# EAGLE design ESP32-ADC (EAGLE 9.6.2)
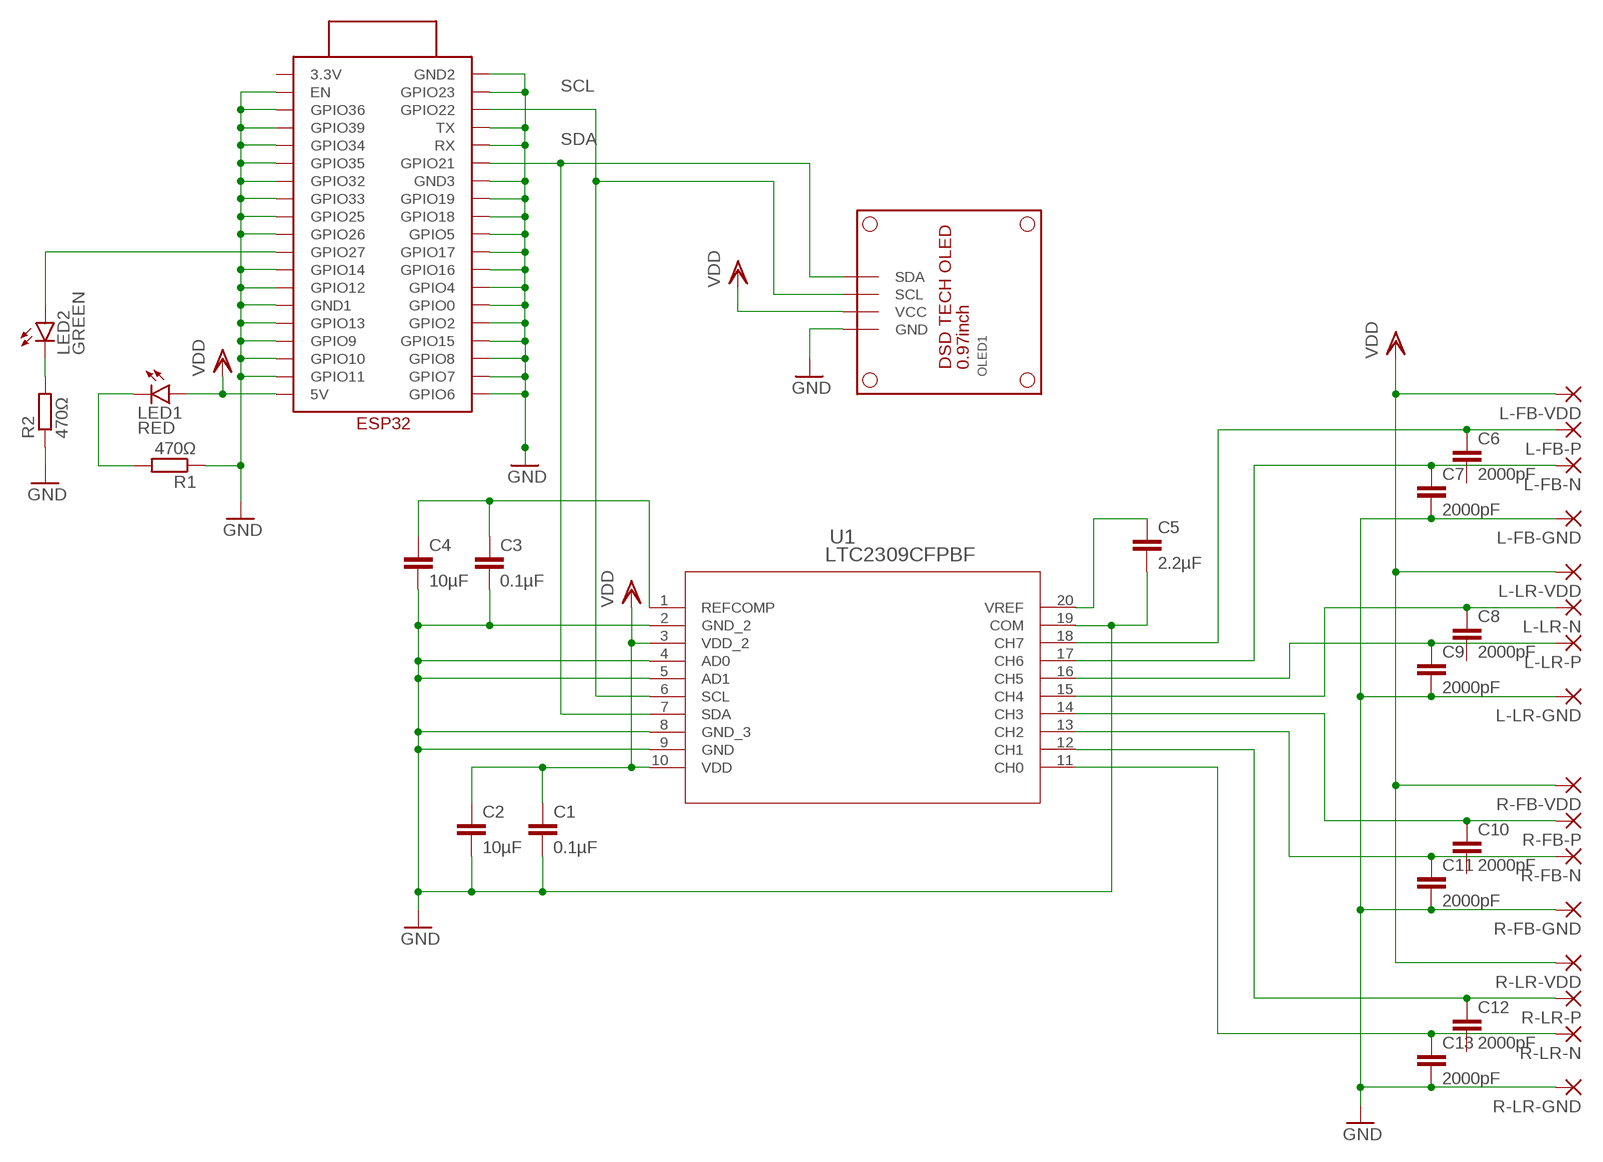
[diagram p0: schematic, sheet 1]

## Parts
C1  0.1µF  C-EUC3216  [C3216]
C2  10µF  C-EUC3216  [C3216]
C3  0.1µF  C-EUC3216  [C3216]
C4  10µF  C-EUC3216  [C3216]
C5  2.2µF  C-EUC3216  [C3216]
C6  2000pF  C-EUC3216  [C3216]
C7  2000pF  C-EUC3216  [C3216]
C8  2000pF  C-EUC3216  [C3216]
C9  2000pF  C-EUC3216  [C3216]
C10  2000pF  C-EUC3216  [C3216]
C11  2000pF  C-EUC3216  [C3216]
C12  2000pF  C-EUC3216  [C3216]
C13  2000pF  C-EUC3216  [C3216]
L-FB-GND  SMD2  [SMD1,27-2,54]
L-FB-N  SMD2  [SMD1,27-2,54]
L-FB-P  SMD2  [SMD1,27-2,54]
L-FB-VDD  SMD2  [SMD1,27-2,54]
L-LR-GND  SMD2  [SMD1,27-2,54]
L-LR-N  SMD2  [SMD1,27-2,54]
L-LR-P  SMD2  [SMD1,27-2,54]
L-LR-VDD  SMD2  [SMD1,27-2,54]
LED1  RED  LED3MM  [LED3MM]
LED2  GREEN  LED3MM  [LED3MM]
OLED1  DSDTECH_ARDUINO_AVRCOMPATIBLE_IIC_OLED  [DSDTECH0.96"ARDUINOAVRCOMPATIBLEIICOLEDLCDSCREENSUPPORTU8GLIB]
R1  470Ω  R-EU_R3216W  [R3216W]
R2  470Ω  R-EU_R3216W  [R3216W]
R-FB-GND  SMD2  [SMD1,27-2,54]
R-FB-N  SMD2  [SMD1,27-2,54]
R-FB-P  SMD2  [SMD1,27-2,54]
R-FB-VDD  SMD2  [SMD1,27-2,54]
R-LR-GND  SMD2  [SMD1,27-2,54]
R-LR-N  SMD2  [SMD1,27-2,54]
R-LR-P  SMD2  [SMD1,27-2,54]
R-LR-VDD  SMD2  [SMD1,27-2,54]
U1  LTC2309CFPBF  [TSSOP-20_F_LIT]
U$2  ESP32ESP32_WIFI  [ESP32_WIFI]

## Nets
GND: C1.2 C2.2 C3.2 C4.2 C5.2 C7.2 C9.2 C11.2 C13.2 L-FB-GND.1(P) L-LR-GND.1(P) OLED1.GND R1.1 R2.1 R-FB-GND.1(P) R-LR-GND.1(P) U1.2(GND_2) U1.4(AD0) U1.5(AD1) U1.8(GND_3) U1.9(GND) U1.19(COM) U$2.EN U$2.GND1 U$2.GND2 U$2.GND3 U$2.GPIO0 U$2.GPIO2 U$2.GPIO4 U$2.GPIO5 U$2.GPIO6 U$2.GPIO7 U$2.GPIO8 U$2.GPIO9 U$2.GPIO10 U$2.GPIO11 U$2.GPIO12 U$2.GPIO13 U$2.GPIO14 U$2.GPIO15 U$2.GPIO16 U$2.GPIO17 U$2.GPIO18 U$2.GPIO19 U$2.GPIO23 U$2.GPIO25 U$2.GPIO26 U$2.GPIO32 U$2.GPIO33 U$2.GPIO34 U$2.GPIO35 U$2.GPIO36 U$2.GPIO39 U$2.RX U$2.TX
N$1: C5.1 U1.20(VREF)
N$2: LED2.A U$2.GPIO27
N$4: C6.1 L-FB-P.1(P) U1.18(CH7)
N$5: C7.1 L-FB-N.1(P) U1.17(CH6)
N$6: C9.1 L-LR-P.1(P) U1.16(CH5)
N$7: C8.1 L-LR-N.1(P) U1.15(CH4)
N$8: C10.1 R-FB-P.1(P) U1.14(CH3)
N$9: C11.1 R-FB-N.1(P) U1.13(CH2)
N$10: C13.1 R-LR-N.1(P) U1.11(CH0)
N$11: C12.1 R-LR-P.1(P) U1.12(CH1)
N$13: LED1.K(C) R1.2
N$14: LED2.K(C) R2.2
SCL: OLED1.SCL U1.6(SCL) U$2.GPIO22
SDA: OLED1.SDA U1.7(SDA) U$2.GPIO21
VCC1: C3.1 C4.1 U1.1(REFCOMP)
VDD: C1.1 C2.1 L-FB-VDD.1(P) L-LR-VDD.1(P) LED1.A OLED1.VCC R-FB-VDD.1(P) R-LR-VDD.1(P) U1.3(VDD_2) U1.10(VDD) U$2.5V
Unconnected: C6.2 C8.2 C10.2 C12.2 U$2.3.3V

## Library data of the parts
C1-C13 = rcl:C-EU: CAPACITOR, European symbol; SPICEPREFIX: C
L-FB-GND L-FB-N L-FB-P L-FB-VDD L-LR-GND L-LR-N L-LR-P L-LR-VDD R-FB-GND R-FB-N R-FB-P R-FB-VDD R-LR-GND R-LR-N R-LR-P R-LR-VDD = wirepad:SMD2: SMD PAD
LED1 LED2 = led:LED: LED OSRAM: - CHIPLED LG R971, LG N971, LY N971, LG Q971, LY Q971, LO R971, LY R971 LH N974, LH R974 LS Q976, LO Q976, LY Q976 LO Q996 - Hyper CHIPLED LW Q18S LB Q993, LB Q99A, LB R99A - SideLED LS A670, LO A670, LY A670, LG A670, LP A670 LB A673, LV A673, LT A673, LW A673 LH A674 LY A675 LS A676, LA A676, LO A676, LY A676, LW A676 LS A679, LY A679, LG A679 - Hyper Micro SIDELED® LS Y876, LA Y876, LO Y876, LY Y876 LT Y87S - SmartLED LW L88C, LW L88S LB L89C, LB L89S, LG L890 LS L89K, LO L89K, LY L89K LS L896, LA L896, LO L896, LY L896 - TOPLED LS T670, LO T670, LY T670, LG T670, LP T670 LSG T670, LSP T670, LSY T670, LOP T670, LYG T670 LG T671, LOG T671, LSG T671 LB T673, LV T673, LT T673, LW T673 LH T674 LS T676, LA T676, LO T676, LY T676, LB T676, LH T676, LSB T676, LW T676 LB T67C, LV T67C, LT T67C, LS T67K, LO T67K, LY T67K, LW E67C LS E67B, LA E67B, LO E67B, LY E67B, LB E67C, LV E67C, LT E67C LW T67C LS T679, LY T679, LG T679 LS T770, LO T770, LY T770, LG T770, LP T770 LB T773, LV T773, LT T773, LW T773 LH T774 LS E675, LA E675, LY E675, LS T675 LS T776, LA T776, LO T776, LY T776, LB T776 LHGB T686 LT T68C, LB T68C - Hyper Mini TOPLED® LB M676 - Mini TOPLED Santana® LG M470 LS M47K, LO M47K, LY M47K Source: http://www.osram.convergy.de LUXEON: - LUMILED® LXK2-PW12-R00, LXK2-PW12-S00, LXK2-PW14-U00, LXK2-PW14-V00 LXK2-PM12-R00, LXK2-PM12-S00, LXK2-PM14-U00 LXK2-PE12-Q00, LXK2-PE12-R00, LXK2-PE12-S00, LXK2-PE14-T00, LXK2-PE14-U00 LXK2-PB12-K00, LXK2-PB12-L00, LXK2-PB12-M00, LXK2-PB14-N00, LXK2-PB14-P00, LXK2-PB14-Q00 LXK2-PR12-L00, LXK2-PR12-M00, LXK2-PR14-Q00, LXK2-PR14-R00 LXK2-PD12-Q00, LXK2-PD12-R00, LXK2-PD12-S00 LXK2-PH12-R00, LXK2-PH12-S00 LXK2-PL12-P00, LXK2-PL12-Q00, LXK2-PL12-R00 Source: www.luxeon.com KINGBRIGHT: KA-3528ASYC Source: www.kingbright.com
OLED1 = DSD TECH Arduino AVR Compatible IIC OLED:DSDTECH_ARDUINO_AVRCOMPATIBLE_IIC_OLED
R1 R2 = rcl:R-EU_: RESISTOR, European symbol; SPICEPREFIX: R
U1 = LTC2309CF_PBF:LTC2309CFPBF; COPYRIGHT: Copyright (C) 2021 Ultra Librarian. All rights reserved.; MANUFACTURER_PART_NUMBER: LTC2309CF#PBF; MFR_NAME: Analog Devices / Linear Technology
U$2 = ESP32:ESP32

## Board
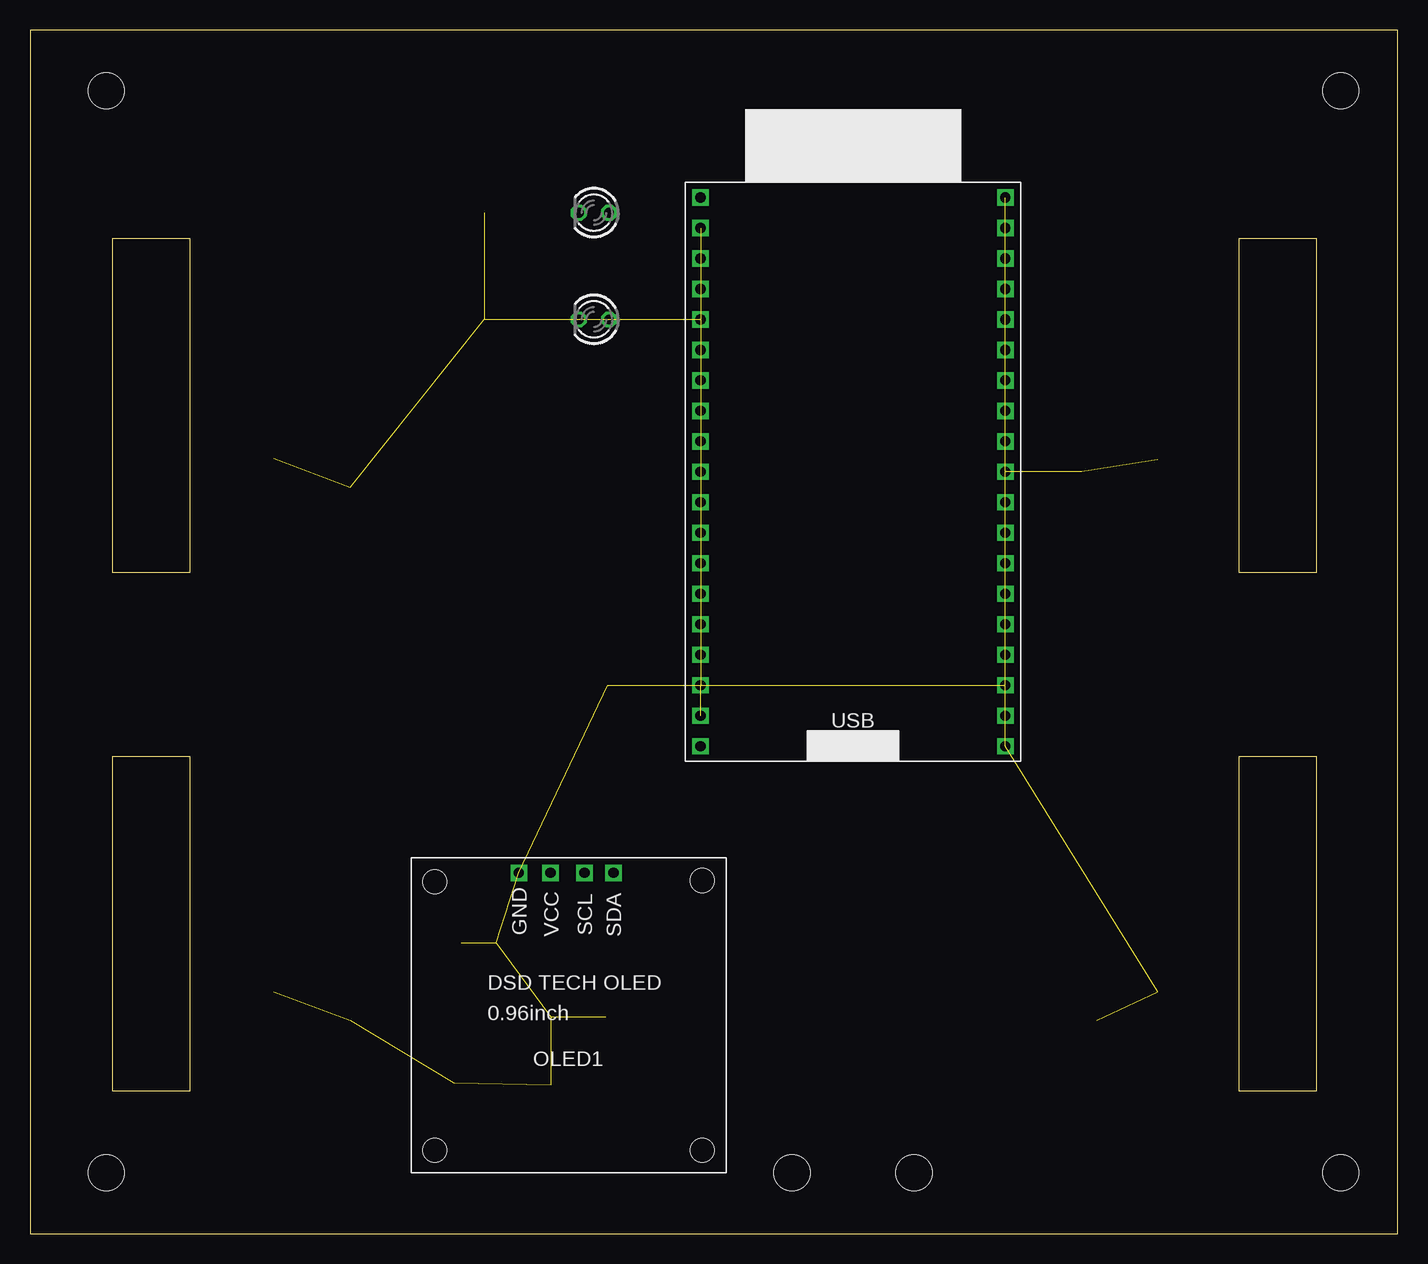
[diagram p1: board, top side]
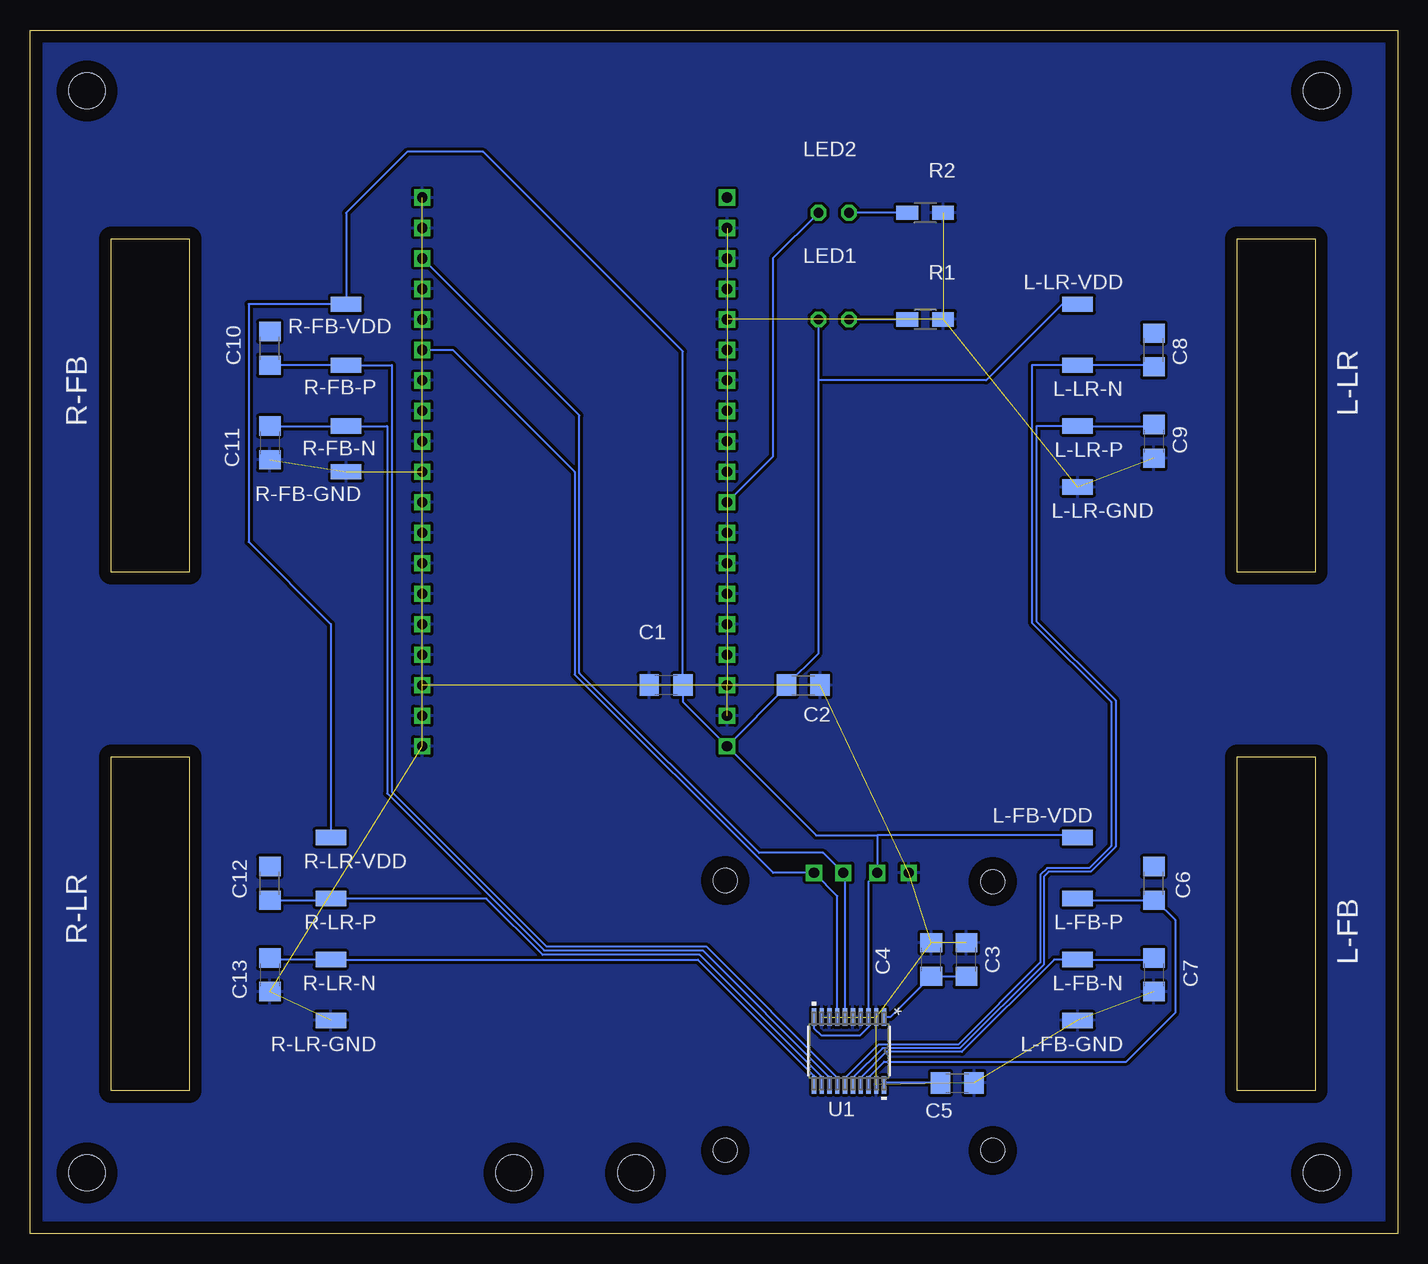
[diagram p2: board, bottom side, seen from below]

Size 113.97 x 100.32 mm. Coordinates in mm from the lower left corner, seen from the top.
Outline: 0,0 113.97,0 113.97,100.32 0,100.32 0,0
Copper layers (1*16): Top 0.035mm / dielectric 1.5mm / Bottom 0.035mm
Design rules "default": minimum track width 6mil, minimum drill 0.35mm, track to track 6mil, track to pad 6mil, pad to pad 6mil, via to via 6mil, smd to smd 6mil, copper to edge 40mil, drill to drill 6mil, minimum pad ring 10mil, minimum via ring 8mil, stop-mask expansion 4mil, vias tented up to drill 0mil, thermal gap 10mil
Holes 3 mm at 6.35,95.25 6.35,5.08 109.22,5.08 109.22,95.25 73.66,5.08 63.5,5.08

### Footprints (pad centres in the part's own frame; a part is rotated, then mirrored left to right if it is on the bottom)
C3216 = smd 1.6 x 1.8: 1 -1.4,0; 2 1.4,0
SMD1,27-2,54 = smd 1.27 x 2.54: 1 0,0
LED3MM = drill 0.813 octagon: A -1.27,0; K 1.27,0
DSDTECH0.96"ARDUINOAVRCOMPATIBLEIICOLEDLCDSCREENSUPPORTU8GLIB = drill 0.85 square: GND 8.99,25; SCL 14.45,25; SDA 16.88,25; VCC 11.62,25 | hole 2: 1.99,1.88; 1.99,24.27; 24.28,24.37; 24.28,1.88
R3216W = smd 1.8 x 1.2: 1 -1.499,0; 2 1.499,0
TSSOP-20_F_LIT = smd 1.462 x 0.355: 1 -2.819,2.926; 2 -2.819,2.276; 3 -2.819,1.626; 4 -2.819,0.975; 5 -2.819,0.325; 6 -2.819,-0.325; 7 -2.819,-0.975; 8 -2.819,-1.626; 9 -2.819,-2.276; 10 -2.819,-2.926; 11 2.819,-2.926; 12 2.819,-2.276; 13 2.819,-1.626; 14 2.819,-0.975; 15 2.819,-0.325; 16 2.819,0.325; 17 2.819,0.975; 18 2.819,1.626; 19 2.819,2.276; 20 2.819,2.926
ESP32_WIFI = drill 0.85 square: 3.3V 1.27,46.99; 5V 1.27,1.27; EN 1.27,44.45; GND1 1.27,13.97; GND2 26.67,46.99; GND3 26.67,31.75; GPIO0 26.67,13.97; GPIO2 26.67,11.43; GPIO4 26.67,16.51; GPIO5 26.67,24.13; GPIO6 26.67,1.27; GPIO7 26.67,3.81; GPIO8 26.67,6.35; GPIO9 1.27,8.89; GPIO10 1.27,6.35; GPIO11 1.27,3.81; GPIO12 1.27,16.51; GPIO13 1.27,11.43; GPIO14 1.27,19.05; GPIO15 26.67,8.89; GPIO16 26.67,19.05; GPIO17 26.67,21.59; GPIO18 26.67,26.67; GPIO19 26.67,29.21; GPIO21 26.67,34.29; GPIO22 26.67,41.91; GPIO23 26.67,44.45; GPIO25 1.27,26.67; GPIO26 1.27,24.13; GPIO27 1.27,21.59; GPIO32 1.27,31.75; GPIO33 1.27,29.21; GPIO34 1.27,36.83; GPIO35 1.27,34.29; GPIO36 1.27,41.91; GPIO39 1.27,39.37; RX 26.67,36.83; TX 26.67,39.37

### Placement (x,y rotation side)
C1  60.96,45.72 180 bottom
C2  49.53,45.72 0 bottom
C3  35.94,22.86 90 bottom
C4  38.86,22.86 90 bottom
C5  36.7,12.57 0 bottom
C6  20.32,29.21 90 bottom
C7  20.32,21.59 270 bottom
C8  20.32,73.66 90 bottom
C9  20.32,66.04 270 bottom
C10  93.98,73.79 90 bottom
C11  93.98,65.91 270 bottom
C12  93.98,29.21 90 bottom
C13  93.98,21.59 270 bottom
L-FB-GND  26.67,17.78 90 bottom
L-FB-N  26.67,22.86 90 bottom
L-FB-P  26.67,27.94 90 bottom
L-FB-VDD  26.67,33.02 90 bottom
L-LR-GND  26.67,62.23 90 bottom
L-LR-N  26.67,72.39 90 bottom
L-LR-P  26.67,67.31 90 bottom
L-LR-VDD  26.67,77.47 90 bottom
LED1  46.99,76.2 180 top
LED2  46.99,85.09 180 top
OLED1  31.75,5.08 0 top
R1  39.37,76.2 180 bottom
R2  39.37,85.09 180 bottom
R-FB-GND  87.63,63.5 90 bottom
R-FB-N  87.63,67.31 90 bottom
R-FB-P  87.63,72.39 90 bottom
R-FB-VDD  87.63,77.47 90 bottom
R-LR-GND  88.9,17.78 90 bottom
R-LR-N  88.9,22.86 90 bottom
R-LR-P  88.9,27.94 90 bottom
R-LR-VDD  88.9,33.02 90 bottom
U1  45.72,15.24 270 bottom
U$2  54.61,39.37 0 top

### Tracks (layer width: path | path; a pad name or v marks a point on that pad's centre or on a via)
GND  (54 unrouted)
  pour Bottom (isolate 0.254, rank 6): -2.54,102.87 -2.54,-2.54 116.84,-2.54 116.84,102.87
N$1
  Bottom 0.152: C5.1 42.64,12.57 U1.20
N$2
  Bottom 0.152: LED2.A 52.07,81.28 52.07,64.77 U$2.GPIO27
N$4
  Bottom 0.152: U1.18 44.04,12.5 44.04,13.11 42.8,14.35 22.61,14.35 18.54,18.41 18.54,26.16 20.19,27.81 C6.1 26.54,27.81 L-FB-P.1 26.67,27.89
N$5
  Bottom 0.152: U1.17 44.65,12.5 44.65,13.11 42.6,15.16 36.32,15.16 28.63,22.86 L-FB-N.1 20.42,22.86 | 20.42,22.86 20.32,22.86 | 20.42,22.86 C7.1
N$6
  Bottom 0.152: 26.67,67.21 L-LR-P.1 | L-LR-P.1 20.45,67.31 C9.1 | L-LR-P.1 30.1,67.31 30.1,51.05 23.5,44.45 23.5,32.26 25.58,30.18 29.08,30.18 29.46,29.79 29.46,22.48 36.47,15.47 42.93,15.47 45.4,13 U1.16
N$7
  Bottom 0.152: C8.1 20.45,72.39 L-LR-N.1 30.48,72.39 30.48,50.93 23.88,44.32 23.88,32.31 25.7,30.48 29.21,30.48 29.77,29.92 29.77,22.63 36.63,15.77 43.27,15.77 46.05,13 U1.15
N$8
  Bottom 0.152: 46.74,12.46 U1.14 46.79,12.5 46.79,13.11 57.63,23.95 70.94,23.95 83.82,36.83 83.82,72.39 R-FB-P.1 C10.1 | C10.1 | C10.1 93.86,72.39
N$9
  Bottom 0.152: U1.13 47.4,12.5 47.4,13.11 57.91,23.62 71.12,23.62 84.2,36.7 84.2,67.31 R-FB-N.1 C11.1
N$10
  Bottom 0.152: U1.11 48.65,13.18 58.32,22.86 R-LR-N.1 93.85,22.86 C13.1
N$11
  Bottom 0.152: U1.12 | 48.01,12.5 U1.12 | C12.1 89.03,27.81 R-LR-P.1 75.95,27.94 71.25,23.24 58.17,23.24 48,13.07 U1.12
N$13
  Bottom 0.152: LED1.K R1.2
N$14
  Bottom 0.152: R2.2 LED2.K
SCL
  Bottom 0.152: U1.6 46.05,29.93 OLED1.SCL 47.87,31.75 53.21,31.75 68.2,46.74 68.2,68.2 U$2.GPIO22
SDA
  Bottom 0.152: U1.7 46.7,28.14 OLED1.SDA 52.05,30.08 68.58,46.61 68.58,63.5 78.74,73.66 U$2.GPIO21
VCC1
  Bottom 0.152: C3.1 C4.1 42.26,18.06 U1.1
VDD
  Bottom 0.152: U$2.5V 59.56,44.32 C1.1 59.56,73.53 59.69,73.66 76.2,90.17 82.55,90.17 87.63,85.09 R-FB-VDD.1 95.76,77.47 95.76,57.66 88.9,50.8 R-LR-VDD.1 | 48.26,71.12 LED1.A | 48.26,71.12 34.29,71.12 27.94,77.47 L-LR-VDD.1 | 27.84,33.02 L-FB-VDD.1 26.86,33.21 43.37,33.21 | U1.10 48.65,17.15 48.01,16.51 44.83,16.51 44.09,17.25 U1.3 44.09,29.36 OLED1.VCC 43.37,33.21 | U$2.5V 50.93,45.59 C2.1 48.26,48.39 48.26,71.12 | U$2.5V 48.45,33.21 43.37,33.21
(copper drawn outside any net)
  shapes: Top area x6

### Text on the board
bPlace: L-LR | R-FB | L-FB | R-LR